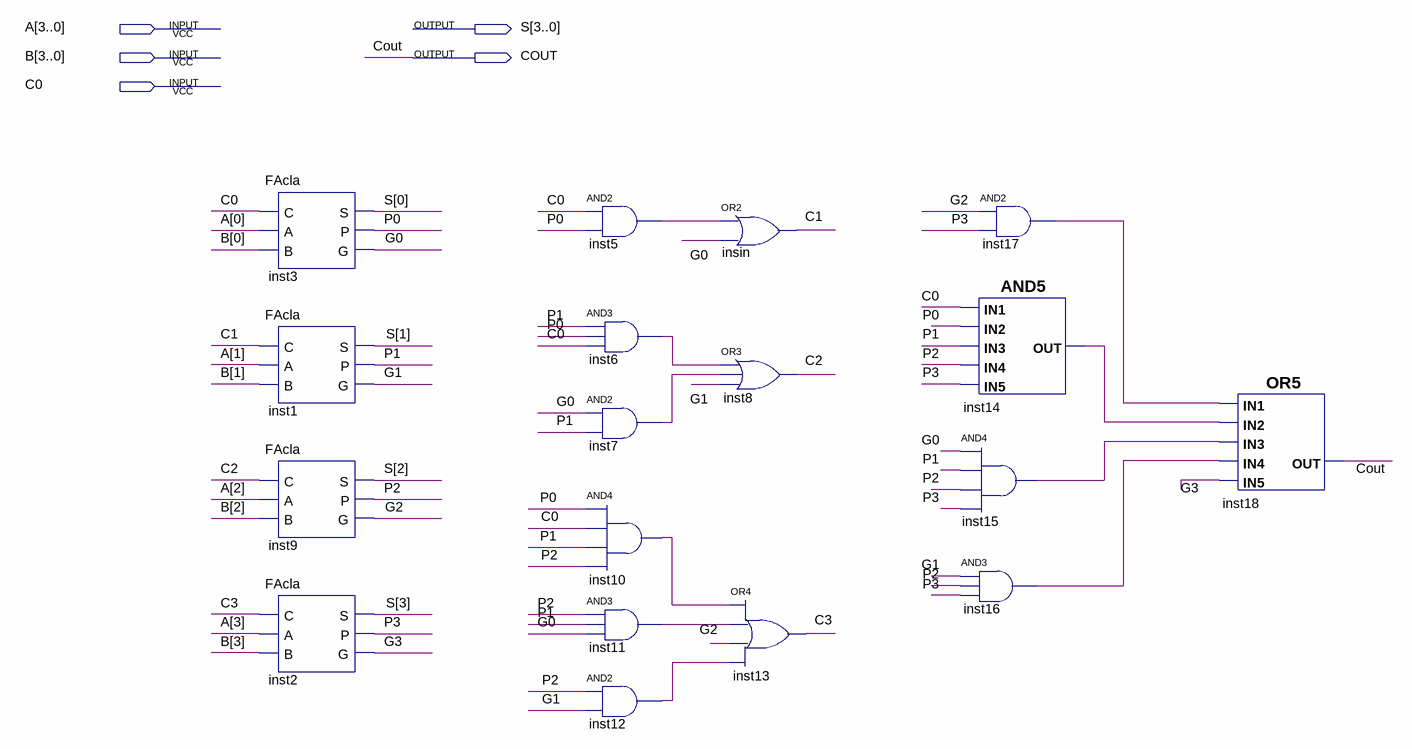
[diagram p0: schematic sheet]
// Quartus schematic CLA_4b.bdf as structural Verilog: 18 symbols, 5 pins
module CLA_4b (
  input  [3:0] A,
  input  [3:0] B,
  input  C0,
  output [3:0] S,
  output COUT
);

  wire C1, C2, C3, G0, G1, G2, G3, inst5_out, inst6_out, inst7_out, inst10_out, inst11_out, inst12_out,
       inst14_out, inst15_out, inst16_out, inst17_out, P0, P1, P2, P3;

  FAcla inst3 (.C(C0), .A(A[0]), .B(B[0]), .S(S[0]), .P(P0), .G(G0));
  FAcla inst1 (.C(C1), .A(A[1]), .B(B[1]), .S(S[1]), .P(P1), .G(G1));
  FAcla inst9 (.C(C2), .A(A[2]), .B(B[2]), .S(S[2]), .P(P2), .G(G2));
  FAcla inst2 (.C(C3), .A(A[3]), .B(B[3]), .S(S[3]), .P(P3), .G(G3));
  and inst5 (inst5_out, C0, P0);
  and inst6 (inst6_out, P1, P0, C0);
  and inst7 (inst7_out, G0, P1);
  and inst10 (inst10_out, P0, C0, P1, P2);
  and inst11 (inst11_out, P2, P1, G0);
  and inst12 (inst12_out, P2, G1);
  or insin (C1, inst5_out, G0);
  or inst8 (C2, inst6_out, inst7_out, G1);
  or inst13 (C3, inst10_out, inst11_out, G2, inst12_out);
  and inst17 (inst17_out, G2, P3);
  and inst14 (inst14_out, C0, P0, P1, P2, P3);
  and inst15 (inst15_out, G0, P1, P2, P3);
  and inst16 (inst16_out, G1, P2, P3);
  or inst18 (COUT, inst17_out, inst14_out, inst15_out, inst16_out, G3);
endmodule
